# EAGLE design recepteur_cpu (EAGLE 6.5.0)
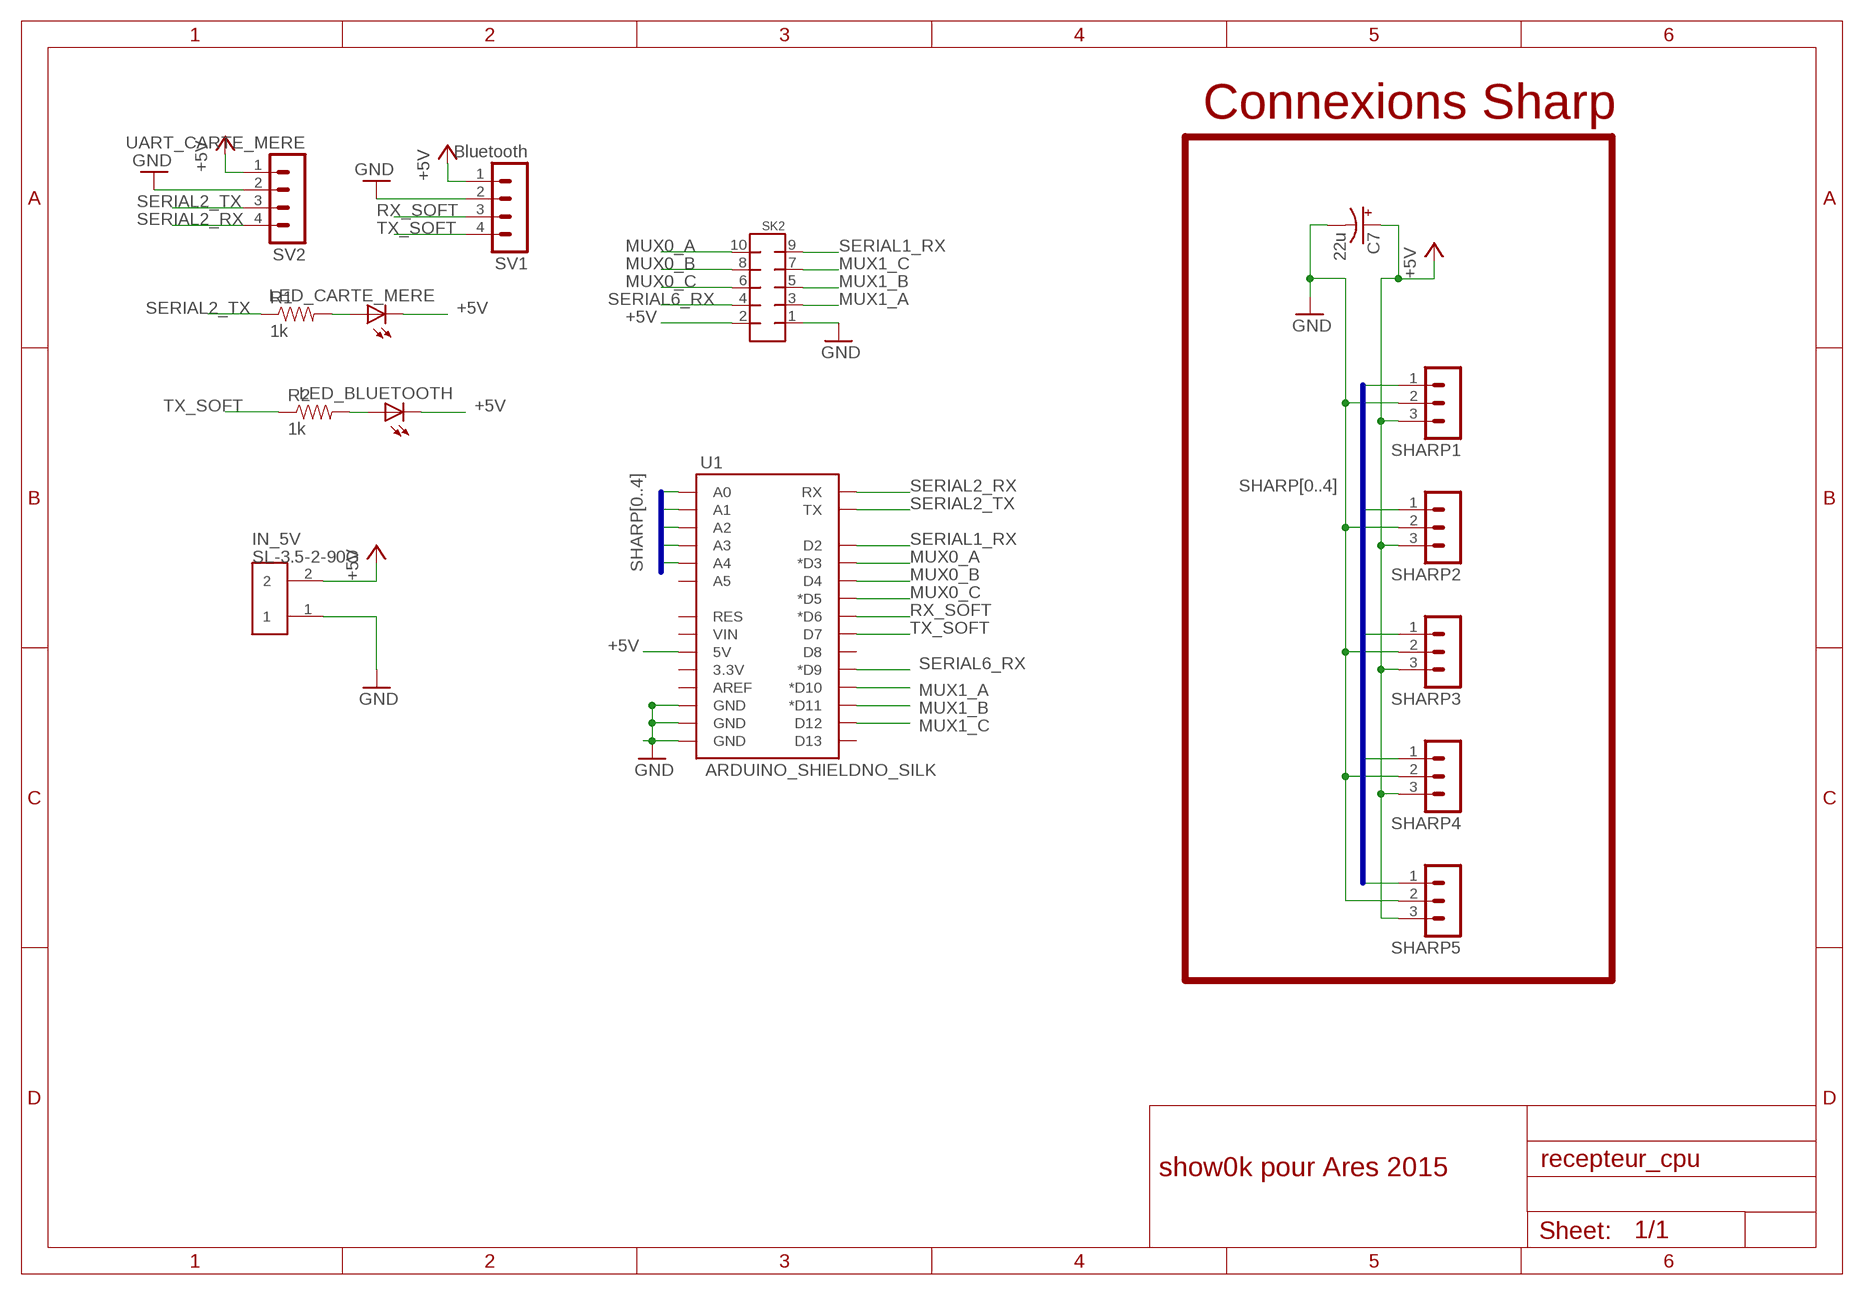
[diagram p0: schematic, sheet 1]

## Parts
C7  22u  CAP_POLPTH1  [CPOL-RADIAL-100UF-25V]
IN_5V  SL-3.5-2-90G  [SL-3.5-2-90G]
LED_BLUETOOTH  LEDCHIPLED_0805  [CHIPLED_0805]
LED_CARTE_MERE  LEDCHIPLED_0805  [CHIPLED_0805]
R1  1k  RESISTOR0805-RES  [0805]
R2  1k  RESISTOR0805-RES  [0805]
SHARP1  MA03-1  [MA03-1]
SHARP2  MA03-1  [MA03-1]
SHARP3  MA03-1  [MA03-1]
SHARP4  MA03-1  [MA03-1]
SHARP5  MA03-1  [MA03-1]
SK2  MMATCH-10-PTH  [AMP-215079-10]
SV1  Bluetooth  MA04-1  [MA04-1]
SV2  UART_CARTE_MERE  MA04-1  [MA04-1]
U1  ARDUINO_SHIELDNO_SILK  [DUEMILANOVE_VIAS]

## Nets
+5V: C7.1(+) IN_5V.2 LED_BLUETOOTH.C LED_CARTE_MERE.C SHARP1.3 SHARP2.3 SHARP3.3 SHARP4.3 SHARP5.3 SK2.2 SV1.1 SV2.1 U1.5V
GND: C7.2(-) IN_5V.1 SHARP1.2 SHARP2.2 SHARP3.2 SHARP4.2 SHARP5.2 SK2.1 SV1.2 SV2.2 U1.GND@0(GND) U1.GND@1(GND) U1.GND@2(GND)
MUX0_A: SK2.10 U1.D3(*D3)
MUX0_B: SK2.8 U1.D4
MUX0_C: SK2.6 U1.D5(*D5)
MUX1_A: SK2.3 U1.D10(*D10)
MUX1_B: SK2.5 U1.D11(*D11)
MUX1_C: SK2.7 U1.D12
N$1: LED_BLUETOOTH.A R2.2
N$15: LED_CARTE_MERE.A R1.2
RX_SOFT: SV1.3 U1.D6(*D6)
SERIAL1_RX: SK2.9 U1.D2
SERIAL2_RX: SV2.4 U1.RX
SERIAL2_TX: R1.1 SV2.3 U1.TX
SERIAL6_RX: SK2.4 U1.D9(*D9)
SHARP0: SHARP1.1 U1.A0
SHARP1: SHARP2.1 U1.A1
SHARP2: SHARP3.1 U1.A2
SHARP3: SHARP4.1 U1.A3
SHARP4: SHARP5.1 U1.A4
TX_SOFT: R2.1 SV1.4 U1.D7
Unconnected: U1.3.3V U1.A5 U1.AREF U1.D8 U1.D13 U1.RES U1.VIN

## Buses
SHARP[0..4]

## Notes on the sheet
- Connexions Sharp
- show0k pour Ares 2015

## Library data of the parts
C7 = SparkFun-Capacitors:CAP_POL: Capacitor Polarized These are standard SMD and PTH capacitors. Normally 10uF, 47uF, and 100uF in electrolytic and tantalum varieties. Always verify the external diameter of the through hole cap, it varies with capacity, voltage, and manufacturer. The EIA devices should be standard.
IN_5V = WEIDMULLER:SL-3.5-2-90G
LED_BLUETOOTH LED_CARTE_MERE = adafruit:LED: LED OSRAM: - CHIPLED LG R971, LG N971, LY N971, LG Q971, LY Q971, LO R971, LY R971 LH N974, LH R974 LS Q976, LO Q976, LY Q976 LO Q996 - Hyper CHIPLED LW Q18S LB Q993, LB Q99A, LB R99A - SideLED LS A670, LO A670, LY A670, LG A670, LP A670 LB A673, LV A673, LT A673, LW A673 LH A674 LY A675 LS A676, LA A676, LO A676, LY A676, LW A676 LS A679, LY A679, LG A679 - Hyper Micro SIDELED® LS Y876, LA Y876, LO Y876, LY Y876 LT Y87S - SmartLED LW L88C, LW L88S LB L89C, LB L89S, LG L890 LS L89K, LO L89K, LY L89K LS L896, LA L896, LO L896, LY L896 - TOPLED LS T670, LO T670, LY T670, LG T670, LP T670 LSG T670, LSP T670, LSY T670, LOP T670, LYG T670 LG T671, LOG T671, LSG T671 LB T673, LV T673, LT T673, LW T673 LH T674 LS T676, LA T676, LO T676, LY T676, LB T676, LH T676, LSB T676, LW T676 LB T67C, LV T67C, LT T67C, LS T67K, LO T67K, LY T67K, LW E67C LS E67B, LA E67B, LO E67B, LY E67B, LB E67C, LV E67C, LT E67C LW T67C LS T679, LY T679, LG T679 LS T770, LO T770, LY T770, LG T770, LP T770 LB T773, LV T773, LT T773, LW T773 LH T774 LS E675, LA E675, LY E675, LS T675 LS T776, LA T776, LO T776, LY T776, LB T776 LHGB T686 LT T68C, LB T68C - Hyper Mini TOPLED® LB M676 - Mini TOPLED Santana® LG M470 LS M47K, LO M47K, LY M47K Source: http://www.osram.convergy.de/
R1 R2 = SparkFun-Passives:RESISTOR: Resistor Basic schematic elements and footprints for 0603, 1206, and PTH resistors.; OC_FARNELL: unknown
SHARP1-SHARP5 = con-lstb:MA03-1: PIN HEADER; OC_FARNELL: unknown; OC_NEWARK: unknown
SK2 = jt-con-micromatch:MMATCH-10-*: AMP Micromatch 10-pin
SV1 SV2 = con-lstb:MA04-1: PIN HEADER; OC_FARNELL: unknown; OC_NEWARK: unknown
U1 = SparkFun-Boards:ARDUINO_SHIELD: Arduino shield footprint

## Board
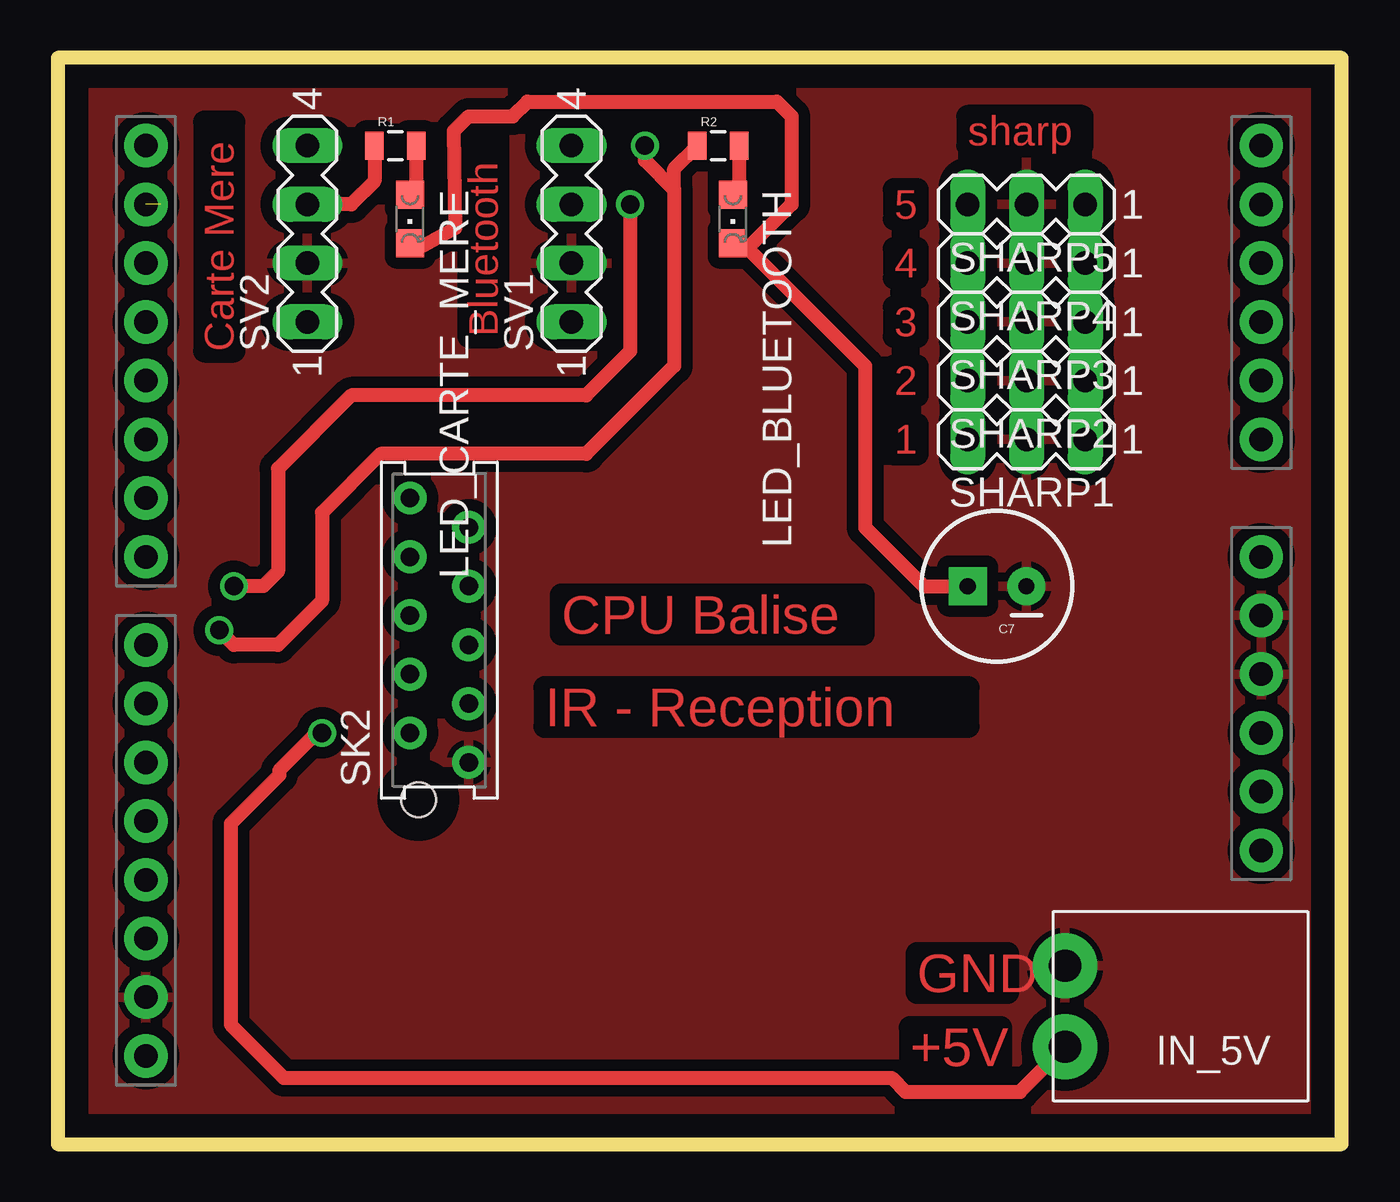
[diagram p1: board, top side]
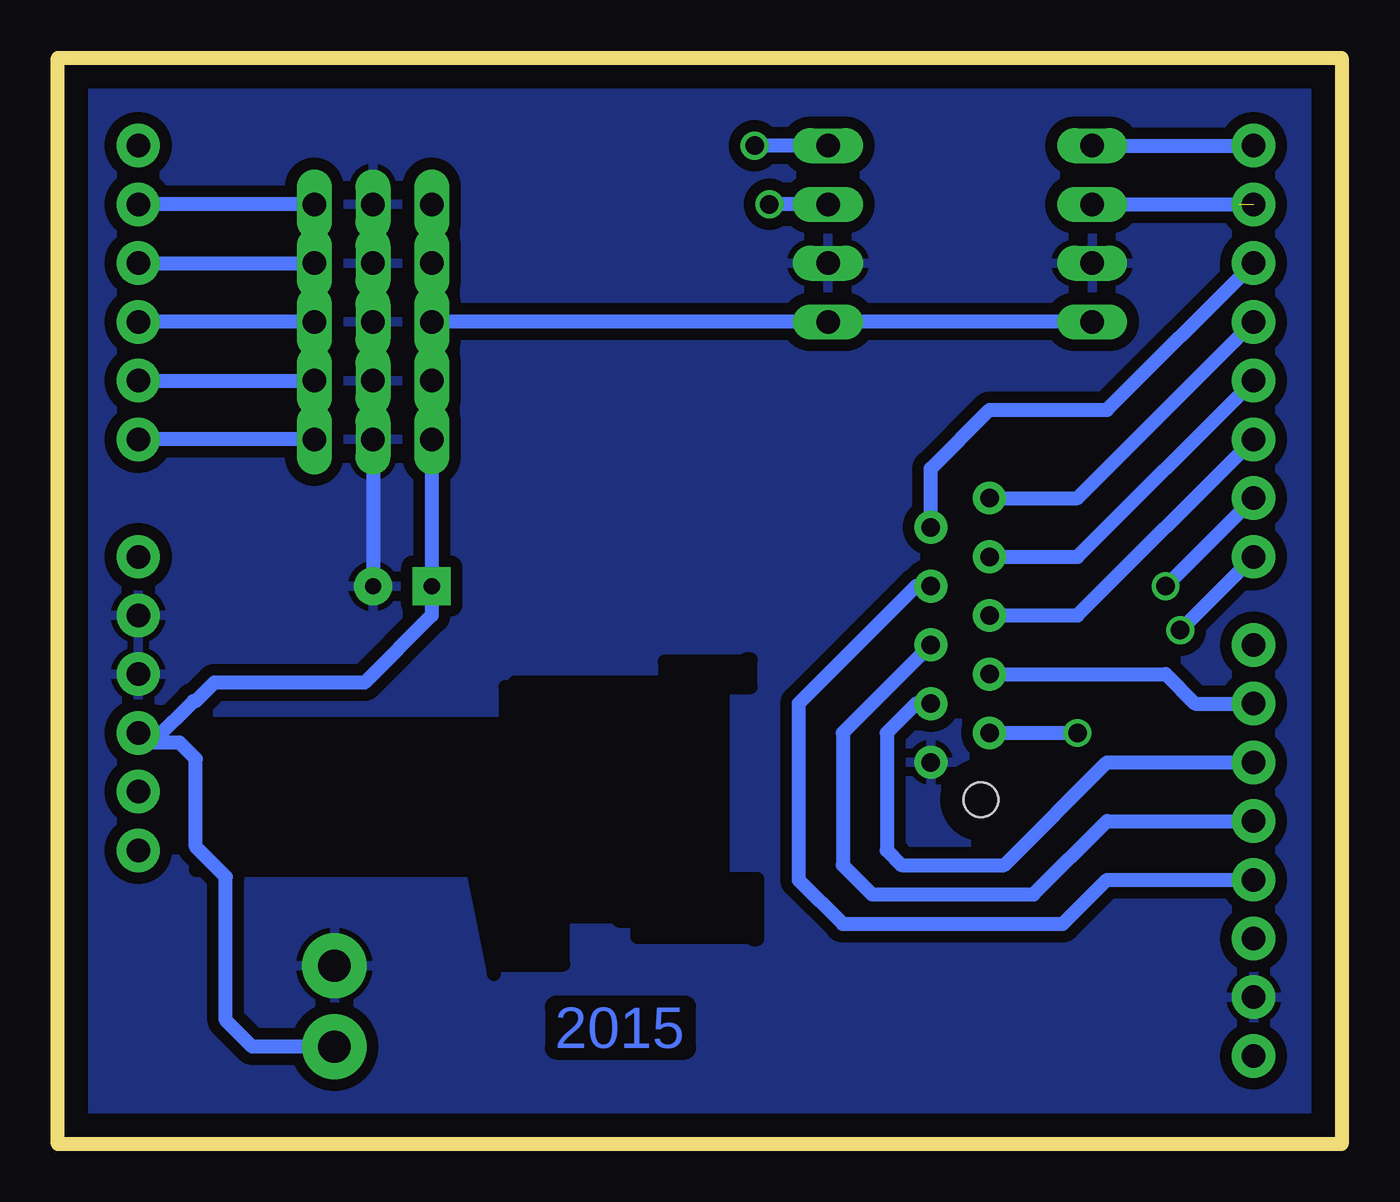
[diagram p2: board, bottom side, seen from below]

Size 55.55 x 46.98 mm. Coordinates in mm from the lower left corner, seen from the top.
Outline: 0,0 55.55,0 55.55,46.98 0,46.98 0,0
Copper layers (1*16): Top 0.1mm / dielectric 1.5mm / Bottom 0.1mm
Design rules "ensea": minimum track width 0.5mm, minimum drill 0.5mm, track to track 0.5mm, track to pad 0.5mm, pad to pad 0.5mm, via to via 0.5mm, smd to smd 8mil, copper to edge 40mil, drill to drill 8mil, minimum pad ring 10mil, minimum via ring 8mil, stop-mask expansion 4mil, vias tented up to drill 0mil, thermal gap 10mil
bRestrict: area 25.3,7.4 to 49.7,21

### Footprints (pad centres in the part's own frame; a part is rotated, then mirrored left to right if it is on the bottom)
CPOL-RADIAL-100UF-25V = drill 0.7 pad 1.651 square: 1 1.27,0 | drill 0.7 pad 1.651: 2 -1.27,0
SL-3.5-2-90G = drill 1.4 pad 2.8: 1 0,-1.75; 2 0,1.75
CHIPLED_0805 = smd 1.2 x 1.2: A 0,-1.05; C 0,1.05
0805 = smd 0.8 x 1.2: 1 -0.9,0; 2 0.9,0
MA03-1 = drill 1.016 long: 1 -2.54,0; 2 0,0; 3 2.54,0
AMP-215079-10 = drill 0.8 pad 1.422: 1 0,-1.27; 2 1.27,1.27; 3 2.54,-1.27; 4 3.81,1.27; 5 5.08,-1.27; 6 6.35,1.27; 7 7.62,-1.27; 8 8.89,1.27; 9 10.16,-1.27; 10 11.43,1.27 | hole 1.5: -1.62,0.905
MA04-1 = drill 1.016 long: 1 -3.81,0; 2 -1.27,0; 3 1.27,0; 4 3.81,0
DUEMILANOVE_VIAS = drill 1.016 pad 1.88: 3.3V 50.8,13.97; 5V 50.8,16.51; A0 50.8,29.21; A1 50.8,31.75; A2 50.8,34.29; A3 50.8,36.83; A4 50.8,39.37; A5 50.8,41.91; AREF 2.54,2.54; D2 2.54,36.83; D3 2.54,34.29; D4 2.54,31.75; D5 2.54,29.21; D6 2.54,26.67; D7 2.54,24.13; D8 2.54,20.32; D9 2.54,17.78; D10 2.54,15.24; D11 2.54,12.7; D12 2.54,10.16; D13 2.54,7.62; GND@0 50.8,19.05; GND@1 50.8,21.59; GND@2 2.54,5.08; RES 50.8,11.43; RX 2.54,41.91; TX 2.54,39.37; VIN 50.8,24.13

### Placement (x,y rotation side)
C7  40.64,24.13 180 top
IN_5V  43.58,5.96 180 top
LED_BLUETOOTH  29.21,40 180 top
LED_CARTE_MERE  15.24,40 180 top
R1  14.6,43.18 0 top
R2  28.58,43.18 0 top
SHARP1  41.91,30.48 180 top
SHARP2  41.91,33.02 180 top
SHARP3  41.91,35.56 180 top
SHARP4  41.91,38.1 180 top
SHARP5  41.91,40.64 180 top
SK2  16.51,16.51 90 top
SV1  22.23,39.37 90 top
SV2  10.79,39.37 90 top
U1  1.27,1.27 0 top

### Tracks (layer width: path | path; a pad name or v marks a point on that pad's centre or on a via)
+5V  (via drill 0.6, 0.8 pad 1.02)
  Top 0.61: LED_BLUETOOTH.C 29.62,38.95 29.84,38.73 | 29.84,38.73 34.92,33.66 34.92,26.67 37.46,24.13 C7.1 | LED_CARTE_MERE.C 15.29,38.75 15.61,38.73 17.2,39.62 17.15,43.81 17.78,44.45 19.69,44.45 20.32,45.09 31.12,45.09 31.75,44.45 31.75,40.64 29.84,38.73 | v11.43,17.78 11.2,17.78 9.58,16.16 9.58,15.96 7.48,13.86 7.48,5.16 9.78,2.86 36.08,2.86 36.68,2.26 41.63,2.26 IN_5V.2
  Bottom 0.61: SHARP5.3 SHARP4.3 SHARP3.3 | SHARP3.3 SHARP2.3 SHARP1.3 C7.1 39.37,22.86 39.38,22.86 42.28,19.96 48.78,19.96 49.58,19.16 49.68,19.16 51.38,17.46 51.75,17.46 U1.5V 51.65,17.36 50.28,17.36 49.58,16.66 49.58,12.86 48.28,11.56 48.28,5.36 47.13,4.21 IN_5V.2 | SK2.2 v11.43,17.78 | SV1.1 SV2.1 SHARP3.3
  other vias: 10.79,35.56
GND
  Bottom 0.61: SHARP5.2 SHARP4.2 SHARP3.2 SHARP2.2 SHARP1.2 C7.2
  pour Bottom: -8.89,50.8 60.96,50.8 61.42,-0.7 -5.57,-1.55
  pour Top: -6.35,46.99 -6.35,-3.81 62.23,-3.81 62.23,49.53 -6.35,49.53
MUX0_A
  Bottom 0.61: SK2.10 11.43,27.94 U1.D3
MUX0_B
  Bottom 0.61: SK2.8 11.43,25.4 U1.D4
MUX0_C
  Bottom 0.61: SK2.6 11.43,22.86 U1.D5
MUX1_A
  Bottom 0.61: SK2.3 18.41,19.05 19.69,17.78 19.69,12.7 19.05,12.06 14.6,12.06 10.16,16.51 U1.D10
MUX1_B
  Bottom 0.61: SK2.5 21.59,17.78 21.59,12.06 20.32,10.79 13.34,10.79 10.16,13.97 U1.D11
MUX1_C
  Bottom 0.61: SK2.7 18.41,24.13 23.49,19.05 23.49,11.43 21.59,9.53 12.06,9.53 10.16,11.43 U1.D12
N$1
  Top 0.61: R2.2 29.48,41.32 LED_BLUETOOTH.A
N$15
  Top 0.61: R1.2 15.51,41.32 LED_CARTE_MERE.A
RX_SOFT  (via drill 0.8)
  Top 0.61: v7.62,24.13 8.89,24.13 9.52,24.77 9.52,29.21 12.7,32.38 22.86,32.38 24.77,34.29 v24.77,40.64
  Bottom 0.61: v7.62,24.13 U1.D6 | SV1.3 v24.77,40.64
SERIAL1_RX
  Bottom 0.61: SK2.9 17.78,29.21 15.24,31.75 10.16,31.75 U1.D2
SERIAL2_RX
  Bottom 0.61: SV2.4 U1.RX
SERIAL2_TX  (1 unrouted)
  Top 0.61: R1.1 13.7,41.64 12.7,40.64 SV2.3
  Bottom 0.61: SV2.3 4.45,40.64 3.81,40
SERIAL6_RX
  Bottom 0.61: SK2.4 7.62,20.32 6.35,19.05 U1.D9
SHARP0
  Bottom 0.61: SHARP1.1 U1.A0
SHARP1
  Bottom 0.61: U1.A1 SHARP2.1
SHARP2
  Bottom 0.61: SHARP3.1 U1.A2
SHARP3
  Bottom 0.61: U1.A3 SHARP4.1
SHARP4
  Bottom 0.61: SHARP5.1 U1.A4
TX_SOFT  (via drill 0.8)
  Top 0.61: v6.98,22.23 7.62,21.59 9.52,21.59 11.43,23.49 11.43,27.3 13.97,29.84 22.86,29.84 26.67,33.66 26.67,41.27 | v25.4,43.18 25.4,42.54 26.67,41.27 | 26.67,41.27 26.67,42.17 R2.1
  Bottom 0.61: v6.98,22.23 U1.D7 | SV1.4 v25.4,43.18

### Text on the board
Top: sharp | 5 | 4 | Carte Mere | Bluetooth | 3 | 2 | 1 | CPU Balise | IR - Reception | GND | +5V
Bottom: 2015